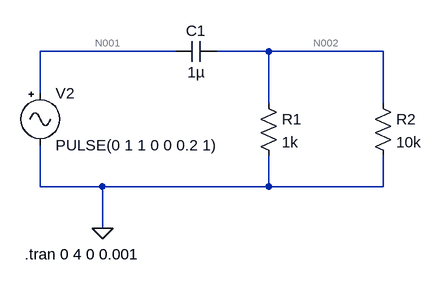
[diagram p0: schematic schemat.asc]
schemat.asc, the LTspice schematic file:
Version 4
SHEET 1 880 680
WIRE 64 -16 -144 -16
WIRE 208 -16 128 -16
WIRE 384 -16 208 -16
WIRE -144 48 -144 -16
WIRE 208 64 208 -16
WIRE 384 64 384 -16
WIRE -144 192 -144 128
WIRE -48 192 -144 192
WIRE 208 192 208 144
WIRE 208 192 -48 192
WIRE 384 192 384 144
WIRE 384 192 208 192
WIRE -48 256 -48 192
FLAG -48 256 0
SYMBOL Misc\\signal -144 32 R0
WINDOW 123 0 0 Left 0
WINDOW 39 0 0 Left 0
SYMATTR InstName V2
SYMATTR Value PULSE(0 1 1 0 0 0.2 1)
SYMBOL cap 128 -32 R90
WINDOW 0 0 32 VBottom 2
WINDOW 3 32 32 VTop 2
SYMATTR InstName C1
SYMATTR Value 1µ
SYMBOL res 192 48 R0
SYMATTR InstName R1
SYMATTR Value 1k
SYMBOL res 368 48 R0
SYMATTR InstName R2
SYMATTR Value 10k
TEXT -168 296 Left 2 !.tran 0 4 0 0.001

The netlist it stands for:
* schemat.asc
V2 N001 0 PULSE(0 1 1 0 0 0.2 1)
C1 N002 N001 1µ
R1 N002 0 1k
R2 N002 0 10k
.tran 0 4 0 0.001
.backanno
.end

* Results of the author's LTspice run, read from the files saved beside the schematic
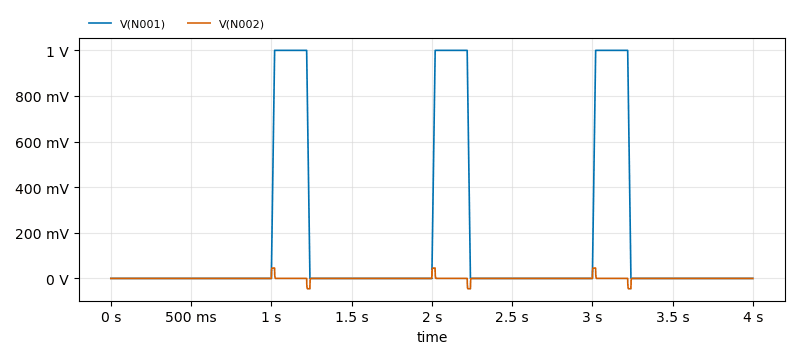
[diagram p1: Transient Analysis of schemat.asc, plotted from the saved traces]
* Transient Analysis, 1 run:
*   V(N001): min 0 V, max 1 V, average 165 mV, rms 401.3 mV, last 0 V
*   V(N002): min -45.48 mV, max 45.47 mV, average 4.142 µV, rms 7.68 mV, last 0 V